# Altium schematic sheet SFP.SchDoc: SFP
size 420 x 297 mm; Organization: Altium Limited; Address1: L3, 12a Rodborough Rd; Address2: Frenchs Forest; Address3: NSW; Address4: Australia 2086; SheetNumber: 7; SheetTotal: 8
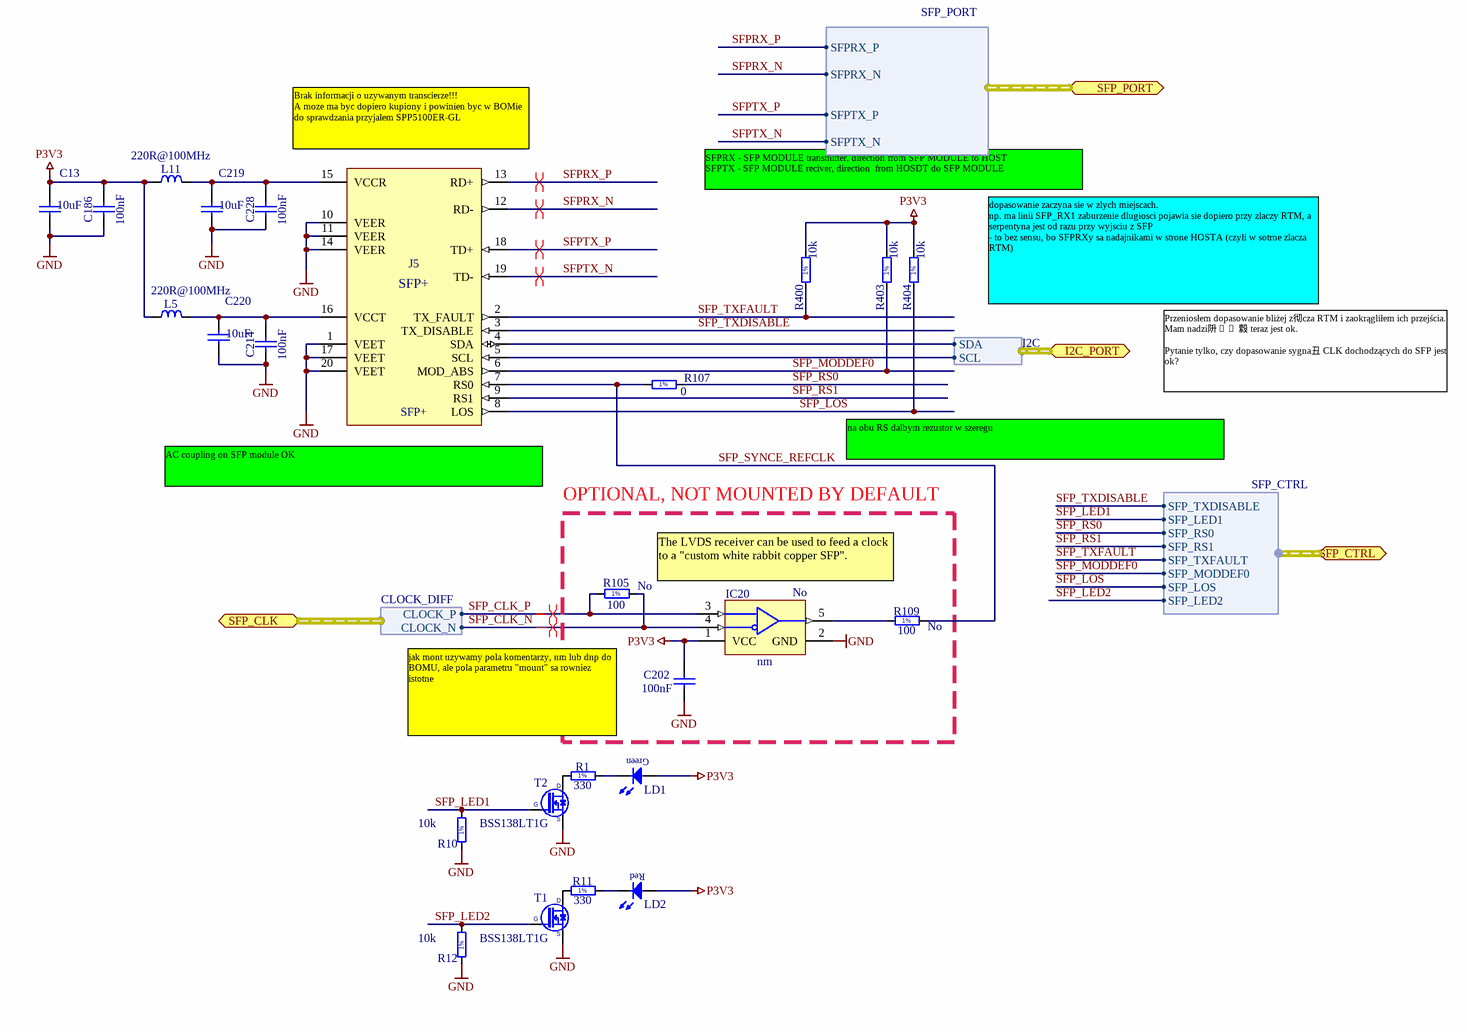
[diagram p0: SFP.SchDoc]

## Parts
C13  10uF  [CAPC2012X135N]
C186  100nF  [CAPC1005X55N]
C202  100nF  [CAPC1005X55N]
C214  100nF  [CAPC1005X55N]
C219  10uF  [CAPC2012X135N]
C220  10uF  [CAPC2012X135N]
C228  100nF  [CAPC1005X55N]
IC20  nm  Mounted: No  [SOT95P280X145-5N]
J5  SFP+  [TYCO_1888247-1]
L5  220R@100MHz  [INDC2012X105N]
L11  220R@100MHz  [INDC2012X105N]
LD1  Green  [LED_AVAGO_HSME-C120]  (value not drawn)
LD2  Red  [LED_AVAGO_HSME-C120]  (value not drawn)
R1  330  [RESC1608X55N]
R10  10k  [RESC1608X55N]
R11  330  [RESC1608X55N]
R12  10k  [RESC1608X55N]
R105  100  Mounted: No  [RESC1608X55N]
R107  0  [RESC1608X55N]
R109  100  Mounted: No  [RESC1608X55N]
R400  10k  [RESC1608X55N]
R403  10k  [RESC1608X55N]
R404  10k  [RESC1608X55N]
T1  BSS138LT1G  [SOT95P240X110-3N]
T2  BSS138LT1G  [SOT95P240X110-3N]

## Blocks framed on the sheet
OPTIONAL, NOT MOUNTED BY DEFAULT: C202 IC20 R105 R109

## Ports
I2C_PORT (harness I2C), SFP_CLK (harness CLOCK_DIFF), SFP_CTRL (harness SFP_CTRL), SFP_PORT (harness SFP_PORT)

## Harnesses
I2C: SCL, SDA
CLOCK_DIFF: CLOCK_P, CLOCK_N
SFP_PORT: SFPRX_P, SFPRX_N, SFPTX_P, SFPTX_N
SFP_CTRL: SFP_LED1, SFP_TXFAULT, SFP_TXDISABLE, SFP_MODDEF0, SFP_RS0, SFP_RS1, SFP_LOS, SFP_LED2

## Nets
GND: C13.2 C186.2 C202.1 C214.2 C219.2 C220.2 C228.2 IC20.2(GND) J5.1(VEET) J5.10(VEER) J5.11(VEER) J5.14(VEER) J5.17(VEET) J5.20(VEET) R10.1 R12.1 T1.2(S) T2.2(S)
P3V3: C13.1 C186.1 C202.2 IC20.1(VCC) L5.1 L11.1 LD1.1(A) LD2.1(A) R400.2 R403.2 R404.2
SFP_CLK_N: IC20.4(B) R105.2 ; port SFP_CLK.CLOCK_N
SFP_CLK_P: IC20.3(A) R105.1 ; port SFP_CLK.CLOCK_P
SFP_LED1: R10.2 T2.1(G) ; port SFP_CTRL.SFP_LED1
SFP_LED2: R12.2 T1.1(G) ; port SFP_CTRL.SFP_LED2
SFP_LOS: J5.8(LOS) R404.1 ; port SFP_CTRL.SFP_LOS
SFP_MODDEF0: J5.6(MOD_ABS) R403.1 ; port SFP_CTRL.SFP_MODDEF0
SFP_RS0: R107.2 ; port SFP_CTRL.SFP_RS0
SFP_RS1: J5.9(RS1) ; port SFP_CTRL.SFP_RS1
SFP_SYNCE_REFCLK: J5.7(RS0) R107.1 R109.2
SFP_TXDISABLE: J5.3(TX_DISABLE) ; port SFP_CTRL.SFP_TXDISABLE
SFP_TXFAULT: J5.2(TX_FAULT) R400.1 ; port SFP_CTRL.SFP_TXFAULT
SFPRX_N: J5.12(RD-) ; port SFP_PORT.SFPRX_N
SFPRX_P: J5.13(RD+) ; port SFP_PORT.SFPRX_P
SFPTX_N: J5.19(TD-) ; port SFP_PORT.SFPTX_N
SFPTX_P: J5.18(TD+) ; port SFP_PORT.SFPTX_P
NetC214_1: C214.1 C220.1 J5.16(VCCT) L5.2
NetC219_1: C219.1 C228.1 J5.15(VCCR) L11.2
NetIC20_5: IC20.5(R) R109.1
NetJ5_4: J5.4(SDA) ; port I2C_PORT.SDA
NetJ5_5: J5.5(SCL) ; port I2C_PORT.SCL
NetLD1_2: LD1.2(C) R1.2
NetLD2_2: LD2.2(C) R11.2
NetR1_1: R1.1 T2.3(D)
NetR11_1: R11.1 T1.3(D)

## Layout directives
differential pair: SFP_CLK_N, SFP_CLK_P, SFPRX_N, SFPRX_P, SFPTX_N, SFPTX_P

## Notes on the sheet
- (near J5) Brak informacji o uzywanym transcierze!!!
  A moze ma byc dopiero kupiony i powinien byc w BOMie
  do sprawdzania przyjalem SPP5100ER-GL
- SFPRX - SFP MODULE transmitter, direction from SFP MODULE to HOST
  SFPTX - SFP MODULE reciver, direction  from HOSDT do SFP MODULE
- dopasowanie zaczyna sie w zlych miejscach.
  np. ma linii SFP_RX1 zaburzenie dlugiosci pojawia sie dopiero przy zlaczy RTM, a serpentyna jest od razu przy wyjsciu z SFP
  - to bez sensu, bo SFPRXy sa nadajnikami w strone HOSTA (czyli w sotrne zlacza RTM)
- Przeniosłem dopasowanie bliżej z彻cza RTM i zaokrągliłem ich przejścia. Mam nadzi阩�, 縠 teraz jest ok.
  Pytanie tylko, czy dopasowanie sygna丑 CLK dochodzących do SFP jest ok?
- (near J5) AC coupling on SFP module OK
- na obu RS dalbym rezustor w szeregu
- The LVDS receiver can be used to feed a clock to a "custom white rabbit copper SFP".
- jak mont uzywamy pola komentarzy, nm lub dnp do BOMU, ale pola parametru "mount" sa rowniez istotne
- Project/Equipment
- Document
- uTCA RTM 8 SFP+
- Designer
- Drawn by
- Check.by
- Copyright Creotech Instruments SA 2014.
  This documentation describes Open Hardware and is licensed under the CERN OHL v.1.1. You may redistribute and modify this documentation under the terms of the CERN OHL v.1.1. (http://ohwr.org/CERNOHL). This documentation is distributed WITHOUT ANY EXPRESS OR IMPLIED WARRANTY, INCLUDING OF MERCHANTABILITY, SATISFACTORY QUALITY AND FITNESS FOR A PARTICULAR PURPOSE. Please see the CERN OHL v.1.1 for applicable conditions.
- Creotech Instruments S.A.
- File
- Last Mod.
- Print Date
- Sheet
- Size
- A3
- of
- Rev
- (in symbol R0603_0R_JUMPER) 1%
- (in symbol R0603_10K_1%_0.1W_100PPM) 1%
- (in symbol R0603_100R_1%_0.1W_100PPM) 1%
- (in symbol R0603_330R_1%_0.1W_100PPM) 1%

## Library data of the parts
C13 C219 C220 = CC0805_10UF_10V_10%_X7R: Non-polarised capacitor; Part Description: SMD Multilayer Chip Ceramic Capacitor; Manufacturer: GENERIC; Manufacturer1 Part Number: GRM21BR71A106KE51L; Voltage: 10V; TC: X7R; Tolerance: ±10%; Table: Capacitors SMD; Part Number: CC0805_10UF_10V_10%_X7R; Component Kind: Standard; Component Type: Standard; Pin Count: 2; Value: 10uF; Status: Preferred; Manufacturer Part Number: CC0805_10UF_10V_10%_X7R; Case: 0805; Mounted: Yes; Socket: No; SMD: Yes; Manufacturer1 Example: MURATA; Manufacturer1 ComponentHeight: 1.35mm; HelpURL: \\cern.ch\dfs\Applications\Altium\Datasheets\CC0805_X7R_MURATA.pdf; Author: CERN DEM JLC; CreateDate: 2012-04-30; LatestRevisionDate: 2012-04-30
C186 C214 C228 = CC0402_100NF_16V_10%_X7R: Non-polarised capacitor; Part Description: SMD Multilayer Chip Ceramic Capacitor; Manufacturer: GENERIC; Manufacturer1 Part Number: 223878715649; Voltage: 16V; TC: X7R; Tolerance: ±10%; Table: Capacitors SMD; Part Number: CC0402_100NF_16V_10%_X7R; Component Kind: Standard; Component Type: Standard; Pin Count: 2; Value: 100nF; Status: Not Recommended; Manufacturer Part Number: CC0402_100NF_16V_10%_X7R; Case: 0402; Mounted: Yes; Socket: No; SMD: Yes; Manufacturer1 Example: PHYCOMP; Manufacturer1 ComponentHeight: 0.55mm; HelpURL: \\cern.ch\dfs\Applications\Altium\Datasheets\CC0402_X7R_PHYCOMP.pdf; Author: CERN DEM JLC; CreateDate: 12/3/2007; LatestRevisionDate: 12/3/2007
C202 = CC0402_100NF_16V_10%_X7R: Non-polarised capacitor; Part Description: SMD Multilayer Chip Ceramic Capacitor; Manufacturer: GENERIC; Manufacturer1 Part Number: 223878715649; Voltage: 16V; TC: X7R; Tolerance: ±10%; Mounted: No; Table: Capacitors SMD; Part Number: CC0402_100NF_16V_10%_X7R; Component Kind: Standard; Component Type: Standard; Pin Count: 2; Value: 100nF; Status: Not Recommended; Manufacturer Part Number: CC0402_100NF_16V_10%_X7R; Case: 0402; Socket: No; SMD: Yes; Manufacturer1 Example: PHYCOMP; Manufacturer1 ComponentHeight: 0.55mm; HelpURL: \\cern.ch\dfs\Applications\Altium\Datasheets\CC0402_X7R_PHYCOMP.pdf; Author: CERN DEM JLC; CreateDate: 2007-12-03; LatestRevisionDate: 2007-12-03
IC20 = SN65LVDS2DBVR: High-Speed Differential Line Receiver; Manufacturer: TEXAS INSTRUMENTS; Table: Analog & Interface; Part Number: SN65LVDS2DBVR; Component Kind: Standard; Component Type: Standard; Device: SN65LVDS2DBVR; PackageDescription: SOT, 0.95mm pitch; 5 pin, 1.60mm W X 2.90mm L X 1.45mm H body, IPC Medium Density; Part Description: High-Speed Differential Line Receiver; Manufacturer Part Number: SN65LVDS2DBVR; Pin Count: 5; Case: SOT23-5; Socket: No; SMD: Yes; ComponentHeight: 1.45mm; Author: CERN DEM JLC; HelpURL: \\cern.ch\dfs\Applications\Altium\Datasheets\SN65LVDS2DBVR.pdf; CreateDate: 3/3/2011; LatestRevisionDate: 3/3/2011
J5 = TYCO_1888247-1: 20 Position SFP+ Connector (Small Form-factor Pluggable); Part Description: 20 Position, Pitch 0.8mm SFP+  Receptacle (Small Form-factor Pluggable); Manufacturer: TYCO ELECTRONICS; Table: TYCO; Part Number: TYCO_1888247-1; Component Kind: Standard; Component Type: Standard; Pin Count: 20; Family: SFP+; Mounted: Yes; Socket: No; SMD: Yes; Status: None; Manufacturer Part Number: 1888247-1; ComponentHeight: 5.4mm; HelpURL: \\cern.ch\dfs\Applications\Altium\Datasheets\TYCO_1888247-1.pdf; Author: CERN DEM JLC; CreateDate: 2012-02-27; LatestRevisionDate: 2012-02-27
L5 L11 = IND0805_MURATA_BLM21PG221SN1D: Inductor; Part Description: SMD EMIFIL Suppression Chip Ferrite Bead; Manufacturer: MURATA; Power: 2A; Resistance: 0.05R; Tolerance: ±25%; Table: Inductors SMD; Part Number: IND0805_MURATA_BLM21PG221SN1D; Component Kind: Standard; Component Type: Standard; Pin Count: 2; Value: 220R@100MHz; Status: None; Manufacturer Part Number: BLM21PG221SN1D; Case: 0805; Mounted: Yes; Socket: No; SMD: Yes; ComponentHeight: 1.05mm; HelpURL: \\cern.ch\dfs\Applications\Altium\Datasheets\IND0402_MURATA_BLM21P.pdf; Author: CERN DEM JLC; CreateDate: 25/01/2010; LatestRevisionDate: 25/01/2010
LD1 = LED_SMD_90deg_mini_G: LED Green Avago C120; Part Description: High Performance Right Angle Chip Green LED; Manufacturer: AVAGO TECHNOLOGIES; Manufacturer Part Number: HSME-C120; Table: LEDs & Displays; Part Number: LED_AVAGO_HSME-C120; Component Kind: Standard; Component Type: Standard; Color: Green; PackageDescription: Green Chip LED, 2-Leads, Body 1.7x1.1mm, Side Emitting Package; Pin Count: 2; Mounted: Yes; Socket: No; SMD: Yes; ComponentHeight: 0.7mm; HelpURL: \\cern.ch\dfs\Applications\Altium\Datasheets\LED_AVAGO_HSME-C120.pdf; ComponentLink1URL: \\cern.ch\dfs\Applications\Altium\Datasheets\LED_AVAGO_HSME-C110_DESIGN-GUIDE.pdf; ComponentLink1Description: Design Guide; Author: CERN DEM JMW; CreateDate: 2009-07-22; LatestRevisionDate: 2012-06-20
LD2 = LED_SMD_90deg_mini_R: LED Red Avago C120; Part Number: LED_AVAGO_HSMC-C120; Part Description: High Performance Right Angle Chip Red LED; Manufacturer: AVAGO TECHNOLOGIES; Manufacturer Part Number: HSMC-C120; Table: LEDs & Displays; Component Kind: Standard; Component Type: Standard; Color: Red; Footprint: LED_AVAGO_HSMC-C120; PackageDescription: Red Chip LED, 2-Leads, Body 1.7x1.1mm, Side Emitting Package; Pin Count: 2; Mounted: Yes; Socket: No; SMD: Yes; ComponentHeight: 0.7mm; HelpURL: \\cern.ch\dfs\Applications\Altium\Datasheets\LED_AVAGO_HSME-C120.pdf; ComponentLink1URL: \\cern.ch\dfs\Applications\Altium\Datasheets\LED_AVAGO_HSME-C110_DESIGN-GUIDE.pdf; ComponentLink1Description: Design Guide; Author: CERN DEM JMW; CreateDate: 2009-07-22; LatestRevisionDate: 2012-06-20
R1 R11 = R0603_330R_1%_0.1W_100PPM: Resistor - 1%; Part Description: General Purpose Thick Film Chip Resistor; Manufacturer: GENERIC; Manufacturer1 Part Number: NRC06F3300TRF; Power: 0.1W; TC: ±100ppm/°C; Table: Resistors SMD; Part Number: R0603_330R_1%_0.1W_100PPM; Component Kind: Standard; Component Type: Standard; Pin Count: 2; Value: 330; Status: Preferred; Tolerance: ±1%; Manufacturer Part Number: R0603_330R_1%_0.1W_100PPM; Case: 0603; Mounted: Yes; Socket: No; SMD: Yes; Manufacturer1 Example: NIC COMPONENT; Manufacturer1 ComponentHeight: 0.55mm; HelpURL: \\cern.ch\dfs\Applications\Altium\Datasheets\R0603_NIC_NRC.pdf; Author: CERN DEM JLC; CreateDate: 2007-12-03; LatestRevisionDate: 2008-03-13
R10 R12 R400 R403 R404 = R0603_10K_1%_0.1W_100PPM: Resistor - 1%; Part Description: General Purpose Thick Film Chip Resistor; Manufacturer: GENERIC; Manufacturer1 Part Number: NRC06F1002TRF; Power: 0.1W; TC: ±100ppm/°C; Table: Resistors SMD; Part Number: R0603_10K_1%_0.1W_100PPM; Component Kind: Standard; Component Type: Standard; Pin Count: 2; Value: 10k; Status: Preferred; Tolerance: ±1%; Manufacturer Part Number: R0603_10K_1%_0.1W_100PPM; Case: 0603; Mounted: Yes; Socket: No; SMD: Yes; Manufacturer1 Example: NIC COMPONENT; Manufacturer1 ComponentHeight: 0.55mm; HelpURL: \\cern.ch\dfs\Applications\Altium\Datasheets\R0603_NIC_NRC.pdf; Author: CERN DEM JLC; CreateDate: 12/3/2007; LatestRevisionDate: 3/13/2008
R105 R109 = R0603_100R_1%_0.1W_100PPM: Resistor - 1%; Part Description: General Purpose Thick Film Chip Resistor; Manufacturer: GENERIC; Manufacturer1 Part Number: NRC06F4700TRF; Power: 0.1W; TC: ±100ppm/°C; Table: Resistors SMD; Part Number: R0603_100R_1%_0.1W_100PPM; Component Kind: Standard; Component Type: Standard; Pin Count: 2; Value: 100; Status: Preferred; Tolerance: ±1%; Manufacturer Part Number: R0603_100R_1%_0.1W_100PPM; Case: 0603; Socket: No; SMD: Yes; Manufacturer1 Example: NIC COMPONENT; Manufacturer1 ComponentHeight: 0.55mm; HelpURL: \\cern.ch\dfs\Applications\Altium\Datasheets\R0603_NIC_NRC.pdf; Author: CERN DEM JLC; CreateDate: 12/3/2007; LatestRevisionDate: 3/13/2008
R107 = R0603_0R_JUMPER: Resistor - 1%; Part Description: 1A (0.05R Max DC Resistance) Zero Ohm Jumper; Manufacturer: GENERIC; Manufacturer1 Part Number: NRC06Z0; Table: Resistors SMD; Part Number: R0603_0R_JUMPER; Component Kind: Standard; Component Type: Standard; Pin Count: 2; Value: 0; Status: Preferred; Manufacturer Part Number: R0603_0R_JUMPER; Case: 0603; Mounted: Yes; Socket: No; SMD: Yes; Manufacturer1 Example: NIC COMPONENT; Manufacturer1 ComponentHeight: 0.55mm; HelpURL: \\cern.ch\dfs\Applications\Altium\Datasheets\R0603_NIC_NRC.pdf; Author: CERN DEM JLC; CreateDate: 12/3/2007; LatestRevisionDate: 3/13/2008
T1 T2 = BSS138LT1G: N-CHANNEL MOSFET WITH DIODE; Part Description: 50V 200mA N-Channel Enhancement Mode Field-Effect Transistor; Manufacturer: ON SEMICONDUCTOR; Table: Transistors; Part Number: BSS138LT1G; Component Kind: Standard; Component Type: Standard; Device: BSS138LT1G; PackageDescription: SOT23 3-Leads, Pitch 0.95mm - Body 1.4x3mm, IPC Medium Density; Manufacturer Part Number: BSS138LT1G; Pin Count: 3; Case: SOT23-3; Mounted: Yes; Socket: No; SMD: Yes; ComponentHeight: 1.11mm; HelpURL: \\cern.ch\dfs\Applications\Altium\Datasheets\BSS138LT1G.pdf; Author: CERN DEM JLC; CreateDate: 2009-03-23; LatestRevisionDate: 2009-03-23